# Altium schematic sheet SubBus10.SchDoc
size A
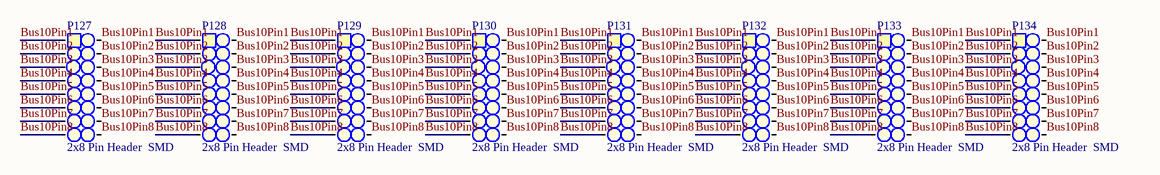
[diagram p0: SubBus10.SchDoc]

## Parts
P127  2x8 Pin Header  SMD  [2X8_SMD_PH_2.54]
P128  2x8 Pin Header  SMD  [2X8_SMD_PH_2.54]
P129  2x8 Pin Header  SMD  [2X8_SMD_PH_2.54]
P130  2x8 Pin Header  SMD  [2X8_SMD_PH_2.54]
P131  2x8 Pin Header  SMD  [2X8_SMD_PH_2.54]
P132  2x8 Pin Header  SMD  [2X8_SMD_PH_2.54]
P133  2x8 Pin Header  SMD  [2X8_SMD_PH_2.54]
P134  2x8 Pin Header  SMD  [2X8_SMD_PH_2.54]

## Nets
Bus10Pin1: P127.1 P127.16 P128.1 P128.16 P129.1 P129.16 P130.1 P130.16 P131.1 P131.16 P132.1 P132.16 P133.1 P133.16 P134.1 P134.16
Bus10Pin2: P127.2 P127.15 P128.2 P128.15 P129.2 P129.15 P130.2 P130.15 P131.2 P131.15 P132.2 P132.15 P133.2 P133.15 P134.2 P134.15
Bus10Pin3: P127.3 P127.14 P128.3 P128.14 P129.3 P129.14 P130.3 P130.14 P131.3 P131.14 P132.3 P132.14 P133.3 P133.14 P134.3 P134.14
Bus10Pin4: P127.4 P127.13 P128.4 P128.13 P129.4 P129.13 P130.4 P130.13 P131.4 P131.13 P132.4 P132.13 P133.4 P133.13 P134.4 P134.13
Bus10Pin5: P127.5 P127.12 P128.5 P128.12 P129.5 P129.12 P130.5 P130.12 P131.5 P131.12 P132.5 P132.12 P133.5 P133.12 P134.5 P134.12
Bus10Pin6: P127.6 P127.11 P128.6 P128.11 P129.6 P129.11 P130.6 P130.11 P131.6 P131.11 P132.6 P132.11 P133.6 P133.11 P134.6 P134.11
Bus10Pin7: P127.7 P127.10 P128.7 P128.10 P129.7 P129.10 P130.7 P130.10 P131.7 P131.10 P132.7 P132.10 P133.7 P133.10 P134.7 P134.10
Bus10Pin8: P127.8 P127.9 P128.8 P128.9 P129.8 P129.9 P130.8 P130.9 P131.8 P131.9 P132.8 P132.9 P133.8 P133.9 P134.8 P134.9

## Library data of the parts
P127-P134 = 2x8 Pin Header  SMD: 2.54mm, SMD; Value: 2x8 Pin Header, 2.54mm, SMD; Farnell: 2356242